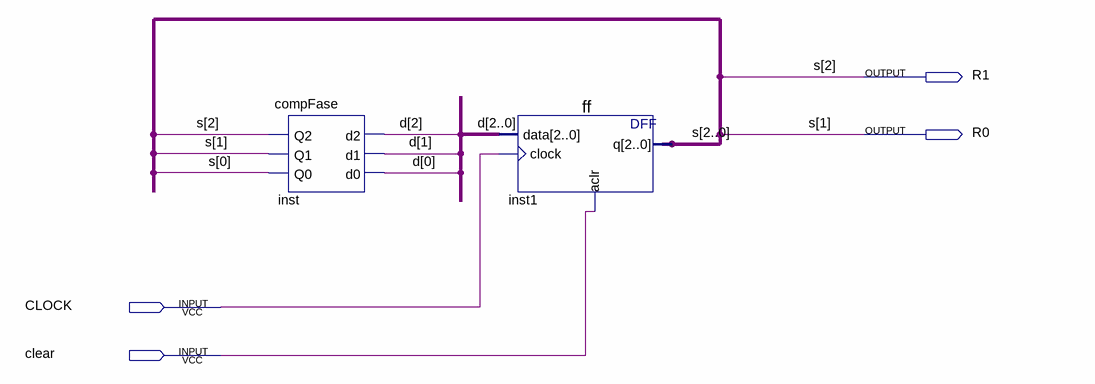
[diagram p0: schematic sheet]
// Quartus schematic comparadorFase.bdf as structural Verilog: 2 symbols, 4 pins
module comparadorFase (
  input  CLOCK,
  input  clear,
  output R1,
  output R0
);

  wire [0:0] s;
  wire [2:0] d;

  compFase inst (.Q2(R1), .Q1(R0), .Q0(s[0]), .d2(d[2]), .d1(d[1]), .d0(d[0]));
  ff inst1 (.data(d), .clock(CLOCK), .aclr(clear), .q({R1, R0, s[0]}));

  // Other names for the same wires on the sheet: s[2:1] = {R1, R0}
endmodule
